# Altium schematic sheet [04] PWR.SchDoc: +5V power supply
size A4; Engineer: M. Folejewski; DocumentNumber: 4; SheetNumber: 4; SheetTotal: 5; PageSize: A4; Designators: 900-949
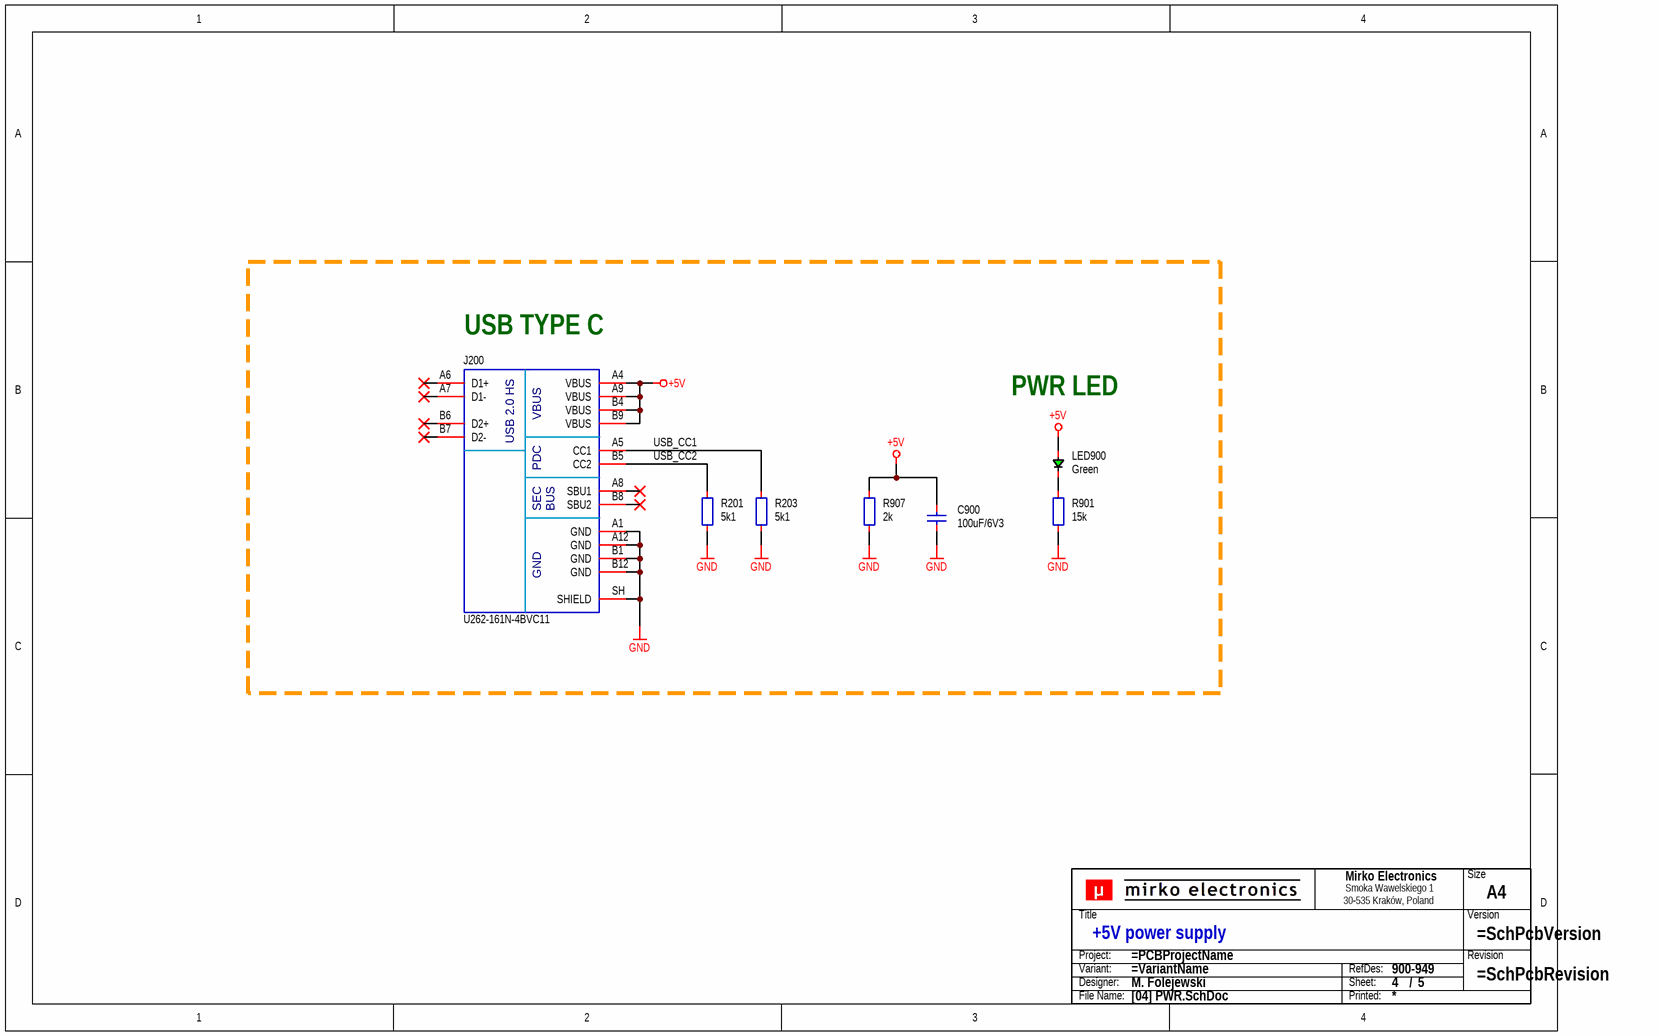
[diagram p0: [04] PWR.SchDoc]

## Parts
C900  100uF/6V3  [CAP_1206_R]
J200  U262-161N-4BVC11  [CON_XKB_U262-161N-4BVC11]
LED900  Green  [LED_0805_GRN_R]
R201  5k1  [RES_0603_R]
R203  5k1  [RES_0603_R]
R901  15k  [RES_0603_R]
R907  2k  [RES_0603_R]
TB?  Title block  (value not drawn)  (graphical)

## Nets
+5V: C900.2 J200.A4(VBUS) J200.A9(VBUS) J200.B4(VBUS) J200.B9(VBUS) LED900.2 R907.2
GND: C900.1 J200.A1(GND) J200.A12(GND) J200.B1(GND) J200.B12(GND) J200.SH(SHIELD) R201.2 R203.2 R901.2 R907.1
USB_CC1: J200.A5(CC1) R203.1
USB_CC2: J200.B5(CC2) R201.1
NetLED900_1: LED900.1 R901.1

Not connected (* = marked no-connect by the designer): J200 A6(D1+)* A7(D1-)* A8(SBU1)* B6(D2+)* B7(D2-)* B8(SBU2)*

## Notes on the sheet
- (near J200) USB TYPE C
- PWR LED
- (in symbol CON_USB_TYPE_C_16P) USB 2.0 HS; PDC; SEC; BUS
- (in symbol SCH_TITLE_BLOCK_V1) Mirko Electronics; Size; Smoka Wawelskiego 1; 30-535 Kraków, Poland; Title; Version; Project:; Revision; Variant:; RefDes:; Designer:; Sheet:; /; File Name:; Printed:

## Library data of the parts
C900 = CAP-0025: Capacitor; MLCC; GENERIC; TBD; TBD; TBD; TBD; SMD; 1206 (3216);; Component Type: Capacitor; Component Subtype: MLCC; Value: 100uF/6V3; Manufacturer: GENERIC; MPN: GENERIC; Mounting Type: SMD; Package (Case): 1206 (3216); Supplier: ?
J200 = CON_USB_TYPE_C_16P: Connector; USB 3.1 Type C; Receptacle; 24-pin; USB 2.0 Only;; Manufacturer: XKB Connectivity; Component Subtype: USB-C; Package (Case): SMD; Value: U262-161N-4BVC11; MPN: U262-161N-4BVC11; Component Type: Connector; Mounting Type: SMD; Supplier: ?
LED900 = DIO_LED_GRN: Diode; LED; Green;; Manufacturer: Foshan NationStar Optoelectronics; MPN: NCD0805G1; Component Subtype: LED Diode; Package (Case): 0805 (2012); Value: Green; Component Type: LED; Mounting Type: SMD; Supplier: LCSC
R201 R203 = RES-0043: Resistor; Thick Film; 5k1; 1%; 100mW; 100PPM; 75V; Standard; SMD; 0603 (1608);; Manufacturer: Yageo Corporation; MPN: TBD; Component Type: Resistor; Component Subtype: Thick Film; Value: 5k1; Mounting Type: SMD; Package (Case): 0603 (1608); Supplier: ?
R901 = RES-0043: Resistor; Thick Film; 15k; 1%; 100mW; 100PPM; 75V; Standard; SMD; 0603 (1608);; Manufacturer: Yageo Corporation; MPN: TBD; Component Type: Resistor; Component Subtype: Thick Film; Value: 15k; Mounting Type: SMD; Package (Case): 0603 (1608); Supplier: ?
R907 = RES-0033: Resistor; Thick Film; 2k2; 1%; 100mW; 100PPM; 75V; Standard; SMD; 0603 (1608);; Manufacturer: Yageo Corporation; MPN: TBD; Component Type: Resistor; Component Subtype: Thick Film; Value: 2k; Mounting Type: SMD; Package (Case): 0603 (1608); Supplier: ?
TB? = SCH_TITLE_BLOCK_V1: Component Type: Title block; Manufacturer: -; Mounting Type: Non component; MPN: -; Operating Temperature: -; Package: -; Specification: Title block; Value: Title block; Replacement: -; System: ?